# Altium project Mosaic-Alto.PrjPcb
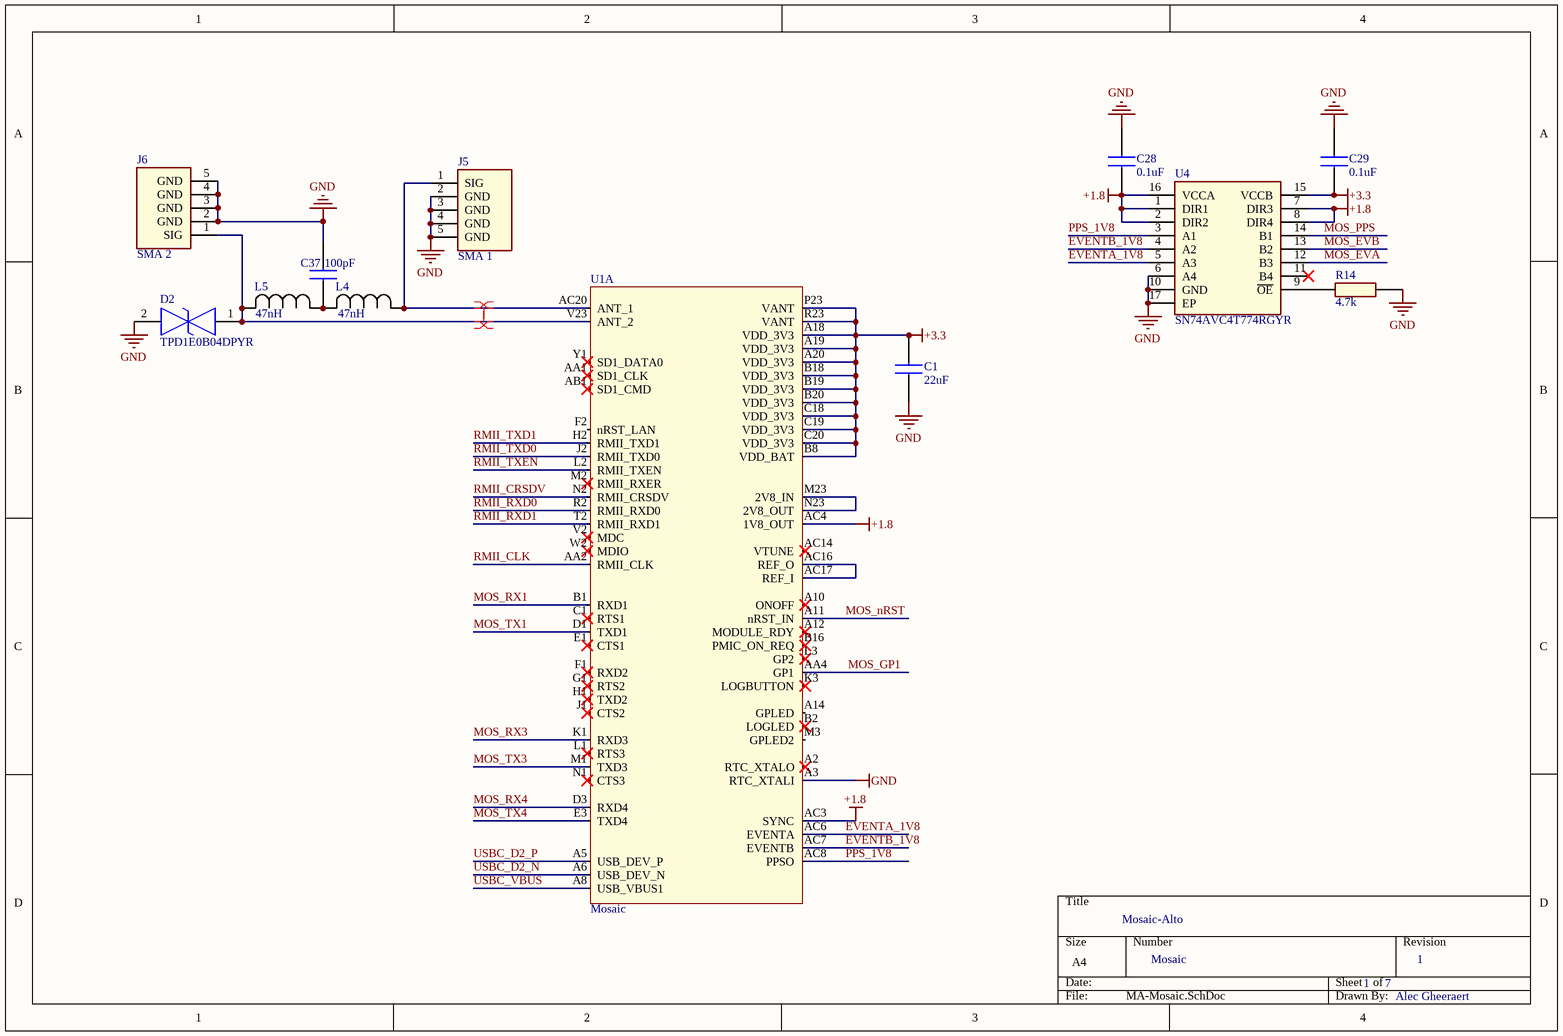
[diagram p0: MA-Mosaic.SchDoc]
7 sheets, 121 parts. Net scope: global (net labels, ports and power ports of the same name join across sheets).
Board file: Mosaic-Alto.PcbDoc
Sheets:
  MA-Mosaic.SchDoc
  MA-Ethernet.SchDoc
  MA-Support.SchDoc
  MA-Power.SchDoc
  MA-Portenta.SchDoc
  MA-USBA.SchDoc
  MA-USBC.SchDoc

## Sheet MA-Mosaic.SchDoc
size A4; SheetNumber: 1; SheetTotal: 7

### Parts
C1  22uF  [CAPC2012X145N]
C28  0.1uF  [CAPC1005X55N]
C29  0.1uF  [CAPC1005X55N]
C37  100pF  [CAPC0603X35N]
D2  TPD1E0B04DPYR  [TPD1E0B04DPYR]
J5  SMA 1  [3-1478978-1]
J6  SMA 2  [3-1478978-1]
L4  47nH  [IND_1005_TDK]
L5  47nH  [IND_1005_TDK]
R14  4.7k  [RESC1005X40N]
U1  Mosaic  [Mosaic]  (part A of 3)
U4  SN74AVC4T774RGYR  [SN74AVC4T774RGYR]

### Nets
+1.8: C28.1 U1.AC3(SYNC) U1.AC4(1V8_OUT) U4.1(DIR1) U4.2(DIR2) U4.7(DIR3) U4.8(DIR4) U4.16(VCCA)
+3.3: C1.1 C29.1 U1.A18(VDD_3V3) U1.A19(VDD_3V3) U1.A20(VDD_3V3) U1.B8(VDD_BAT) U1.B18(VDD_3V3) U1.B19(VDD_3V3) U1.B20(VDD_3V3) U1.C18(VDD_3V3) U1.C19(VDD_3V3) U1.C20(VDD_3V3) U1.P23(VANT) U1.R23(VANT) U4.15(VCCB)
GND: C1.2 C28.2 C29.2 C37.2 D2.2 J5.2(GND) J5.3(GND) J5.4(GND) J5.5(GND) J6.2(GND) J6.3(GND) J6.4(GND) J6.5(GND) R14.2 U1.A3(RTC_XTALI) U4.6(A4) U4.10(GND) U4.17(EP)
EVENTA_1V8: U1.AC6(EVENTA) U4.5(A3)
EVENTB_1V8: U1.AC7(EVENTB) U4.4(A2)
MOS_EVA: U4.12(B3)
MOS_EVB: U4.13(B2)
MOS_GP1: U1.AA4(GP1)
MOS_nRST: U1.A11(nRST_IN)
MOS_PPS: U4.14(B1)
MOS_RX1: U1.B1(RXD1)
MOS_RX3: U1.K1(RXD3)
MOS_RX4: U1.D3(RXD4)
MOS_TX1: U1.D1(TXD1)
MOS_TX3: U1.M1(TXD3)
MOS_TX4: U1.E3(TXD4)
PPS_1V8: U1.AC8(PPSO) U4.3(A1)
RMII_CLK: U1.AA2(RMII_CLK)
RMII_CRSDV: U1.N2(RMII_CRSDV)
RMII_RXD0: U1.R2(RMII_RXD0)
RMII_RXD1: U1.T2(RMII_RXD1)
RMII_TXD0: U1.J2(RMII_TXD0)
RMII_TXD1: U1.H2(RMII_TXD1)
RMII_TXEN: U1.L2(RMII_TXEN)
USBC_D2_N: U1.A6(USB_DEV_N)
USBC_D2_P: U1.A5(USB_DEV_P)
USBC_VBUS: U1.A8(USB_VBUS1)
NetC37_1: C37.1 L4.2 L5.1
NetD2_1: D2.1 J6.1(SIG) L5.2 U1.V23(ANT_2)
NetJ5_1: J5.1(SIG) L4.1 U1.AC20(ANT_1)
NetR14_1: R14.1 U4.9(~{OE})
NetU1_AC16: U1.AC16(REF_O) U1.AC17(REF_I)
NetU1_M23: U1.M23(2V8_IN) U1.N23(2V8_OUT)

Not connected (* = marked no-connect by the designer): U1 A2(RTC_XTALO)* A10(ONOFF)* A12(MODULE_RDY)* A14(GPLED) AA1(SD1_CLK)* AB1(SD1_CMD)* AC14(VTUNE)* B2(LOGLED)* B16(PMIC_ON_REQ)* C1(RTS1)* E1(CTS1)* F1(RXD2)* F2(nRST_LAN) G1(RTS2)* H1(TXD2)* J1(CTS2)* K3(LOGBUTTON)* L1(RTS3)* L3(GP2)* M2(RMII_RXER)* M3(GPLED2) N1(CTS3)* V2(MDC)* W2(MDIO)* Y1(SD1_DATA0)*; U4 11(B4)*

### Layout directives
net class ANT: NetD2_1, NetJ5_1

### Notes on the sheet
- Mosaic-Alto
- Mosaic
- 1
- 7
- Alec Gheeraert

### Library data of the parts
C1 = CMP-00053-2: 0805 22µF; Manufacturer: Walsin; Tolerance: 10%; Dielectric: X5R; Voltage Rating: 6.3V; Min Operating Temperature: 85; Capacitance: 22µF; Max Operating Temperature: -55; Package: 0805
C28 C29 = CMP-00051-3: 0402I 0.1µF; Manufacturer: Walsin; Tolerance: 10%; Dielectric: X7R; Capacitance: 100nF; Voltage Rating: 10V; Min Operating Temperature: -55; Package: 0402; Max Operating Temperature: 125
C37 = CMP-00074-2: 0201 100pF; Capacitance: 100pF
D2 = CMP-00073-2: 1 Channel TVS Diode
J5 J6 = CMP-00069-3: RF SMA Connector
L4 L5 = CMP-00072-2: 47nH 1.4GHz Inductor
R14 = CMP-00030-4: 0402I 4.7k; Manufacturer: Walsin; Power Rating: 62.5mW; Qualification: AEC-Q200; Voltage Rating: 50V; Tolerance: 1%; Max Operating Temperature: 155; Package: 0402; Min Operating Temperature: -55; Resistance: 4.7k
U1 = CMP-00046-3: GNSS RTK Receiver; Manufacturer: Septentrio; Interfaces: USB, UART; Min Operating Temperature: -40; Max Operating Temperature: 85
U4 = CMP-00060-4: 4B Dual-Supply Level Shifter; Manufacturer: Texas Instruments; Delay Time: 2.4ns; Max Supply Voltage: 3.6V; Data Rate: 380Mb/s; Bits: 4; Min Supply Voltage: 1.2V; Package: VQFN-16

## Sheet MA-Ethernet.SchDoc
size A4; SheetNumber: 2; SheetTotal: 7
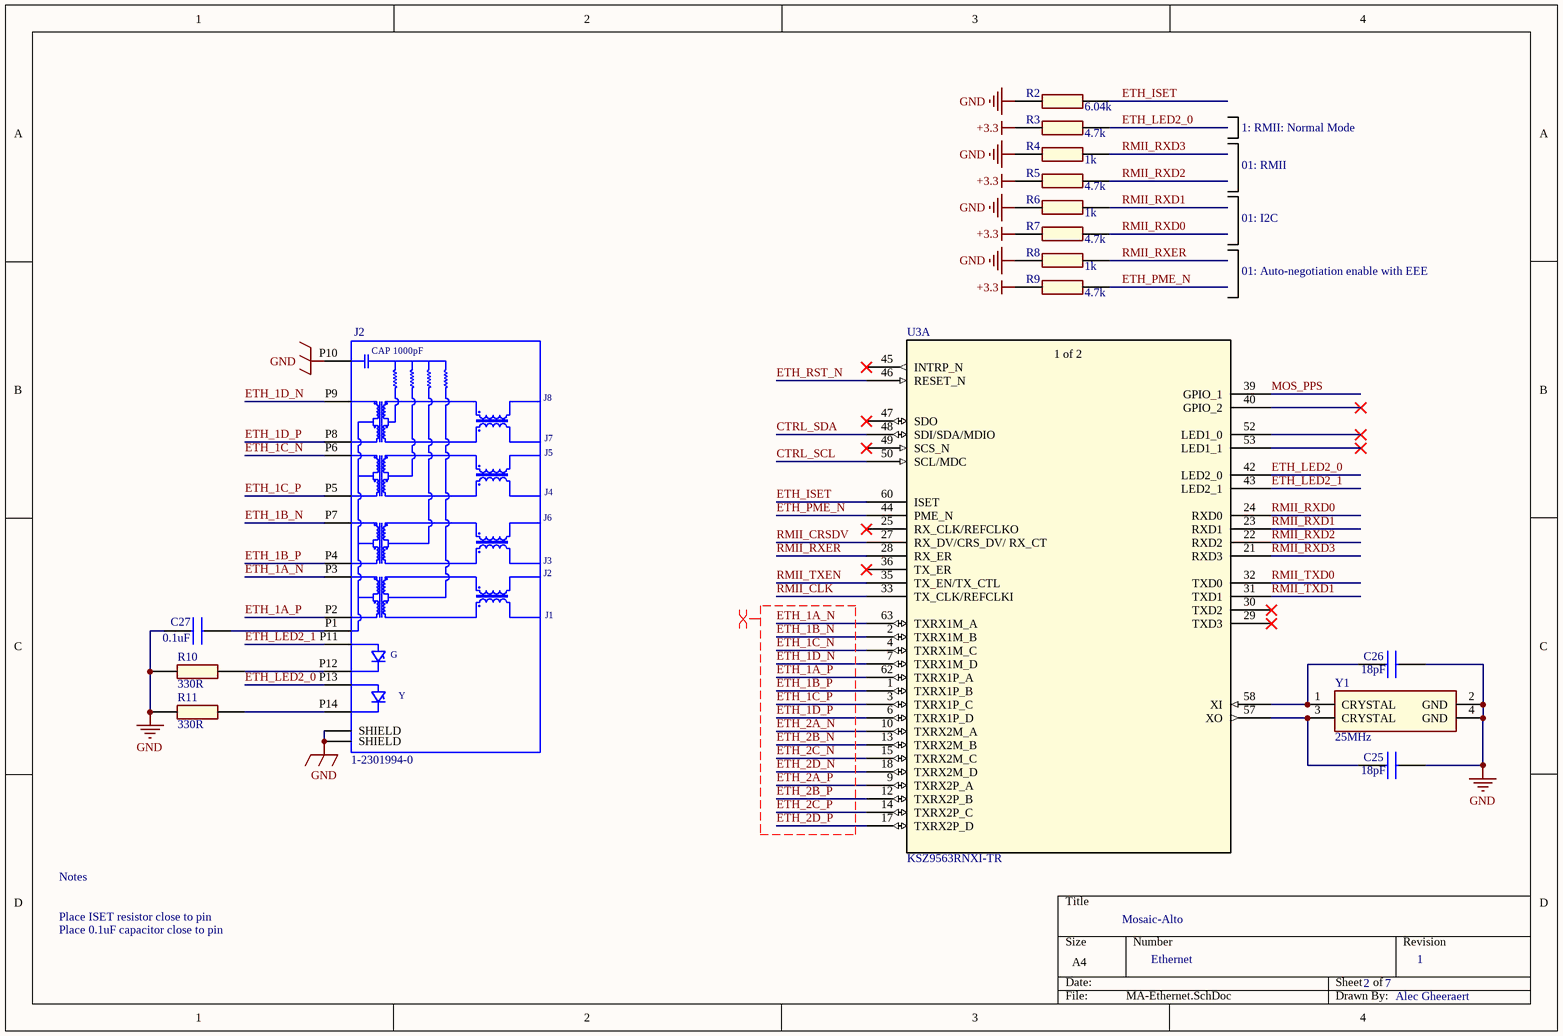
[diagram p1: MA-Ethernet.SchDoc]

### Parts
C25  18pF  [CAPC1608X87N]
C26  18pF  [CAPC1608X87N]
C27  0.1uF  [CAPC2012X145N]
J2  1-2301994-0  [1-2301994-0]
R2  6.04k  [RESC1005X40N]
R3  4.7k  [RESC1005X40N]
R4  1k  [RESC1005X40N]
R5  4.7k  [RESC1005X40N]
R6  1k  [RESC1005X40N]
R7  4.7k  [RESC1005X40N]
R8  1k  [RESC1005X40N]
R9  4.7k  [RESC1005X40N]
R10  330R  [RESC1005X40N]
R11  330R  [RESC1005X40N]
U3  KSZ9563RNXI-TR  [VQFN64_NX_MCH]  (part A of 2)
Y1  25MHz  [LFXTAL055474REEL]

### Nets
+3.3: R3.1 R5.1 R7.1 R9.1
GND: C25.2 C26.2 C27.2 J2.P10 J2.S1(SHIELD) J2.S2(SHIELD) R2.1 R4.1 R6.1 R8.1 R10.2 R11.2 Y1.2(GND) Y1.4(GND)
CTRL_SCL: U3.50(SCL/MDC)
CTRL_SDA: U3.48(SDI/SDA/MDIO)
ETH_1A_N: J2.P3 U3.63(TXRX1M_A)
ETH_1A_P: J2.P2 U3.62(TXRX1P_A)
ETH_1B_N: J2.P7 U3.2(TXRX1M_B)
ETH_1B_P: J2.P4 U3.1(TXRX1P_B)
ETH_1C_N: J2.P6 U3.4(TXRX1M_C)
ETH_1C_P: J2.P5 U3.3(TXRX1P_C)
ETH_1D_N: J2.P9 U3.7(TXRX1M_D)
ETH_1D_P: J2.P8 U3.6(TXRX1P_D)
ETH_2A_N: U3.10(TXRX2M_A)
ETH_2A_P: U3.9(TXRX2P_A)
ETH_2B_N: U3.13(TXRX2M_B)
ETH_2B_P: U3.12(TXRX2P_B)
ETH_2C_N: U3.15(TXRX2M_C)
ETH_2C_P: U3.14(TXRX2P_C)
ETH_2D_N: U3.18(TXRX2M_D)
ETH_2D_P: U3.17(TXRX2P_D)
ETH_ISET: R2.2 U3.60(ISET)
ETH_LED2_0: J2.P13 R3.2 U3.42(LED2_0)
ETH_LED2_1: J2.P11 U3.43(LED2_1)
ETH_PME_N: R9.2 U3.44(PME_N)
ETH_RST_N: U3.46(RESET_N)
MOS_PPS: U3.39(GPIO_1)
RMII_CLK: U3.33(TX_CLK/REFCLKI)
RMII_CRSDV: U3.27(RX_DV/CRS_DV/_RX_CT)
RMII_RXD0: R7.2 U3.24(RXD0)
RMII_RXD1: R6.2 U3.23(RXD1)
RMII_RXD2: R5.2 U3.22(RXD2)
RMII_RXD3: R4.2 U3.21(RXD3)
RMII_RXER: R8.2 U3.28(RX_ER)
RMII_TXD0: U3.32(TXD0)
RMII_TXD1: U3.31(TXD1)
RMII_TXEN: U3.35(TX_EN/TX_CTL)
NetC25_1: C25.1 U3.57(XO) Y1.3(CRYSTAL)
NetC26_1: C26.1 U3.58(XI) Y1.1(CRYSTAL)
NetC27_1: C27.1 J2.P1
NetJ2_P12: J2.P12 R10.1
NetJ2_P14: J2.P14 R11.1

Not connected (* = marked no-connect by the designer): U3 25(RX_CLK/REFCLKO)* 29(TXD3)* 30(TXD2)* 36(TX_ER)* 40(GPIO_2)* 45(INTRP_N)* 47(SDO)* 49(SCS_N)* 52(LED1_0)* 53(LED1_1)*

### Layout directives
differential pair; differential pair class ETH; net class ETH: ETH_1A_N, ETH_1A_P, ETH_1B_N, ETH_1B_P, ETH_1C_N, ETH_1C_P, ETH_1D_N, ETH_1D_P, ETH_2A_N, ETH_2A_P, ETH_2B_N, ETH_2B_P, ETH_2C_N, ETH_2C_P, ETH_2D_N, ETH_2D_P

### Notes on the sheet
- 01: RMII
- 1: RMII: Normal Mode
- 01: I2C
- 01: Auto-negotiation enable with EEE
- Place ISET resistor close to pin
- Notes
- Mosaic-Alto
- Place 0.1uF capacitor close to pin
- Ethernet
- 2
- 7
- 1
- Alec Gheeraert
- (in symbol CMP-00040-2) CAP 1000pF; J8; J7; J5; J4; J6; J3; J1; G; Y
- (in symbol CMP-00057-8, part A) 1 of 2

### Library data of the parts
C25 C26 = CMP-00052-2: 0603 18pF; Manufacturer: Walsin; Dielectric: C0G; Tolerance: 5%; Voltage Rating: 16V; Max Operating Temperature: 125; Package: 0603; Min Operating Temperature: -55; Capacitance: 18pF
C27 = CMP-00059-1: 0805I 0.1µF; Manufacturer: Walsin; Voltage Rating: 50V; Capacitance: 100nF; Qualification: AEC-Q200; Dielectric: X7R; Tolerance: 10%; Min Operating Temperature: 125; Max Operating Temperature: -55; Package: 0805
J2 = CMP-00040-2: RJ45 1Gbit MJ; Manufacturer: TE Connectivity; Magnetic Jack: Yes; Mounting Angle: Right; Data Rate: 10/100/1000 Base-T; Gender: Female; Performance Category: 5e; Max Operating Temperature: 85; USOC: RJ45; Shielding: Yes; Mounting Style: Through Hole; Min Operating Temperature: -40
R2 = CMP-00031-4: 0402I 6.04k; Manufacturer: Walsin; Qualification: AEC-Q200; Tolerance: 1%; Voltage Rating: 50V; Power Rating: 62.5mW; Max Operating Temperature: 155; Resistance: 6.04k; Min Operating Temperature: -55; Package: 0402
R3 R5 R7 R9 = CMP-00030-4: as R14 on sheet MA-Mosaic; Max Operating Temperature: 155; Package: 0402; Min Operating Temperature: -55; Resistance: 4.7k
R4 R6 R8 = CMP-00032-3: 0402I 1k; Manufacturer: Walsin; Voltage Rating: 50V; Qualification: AEC-Q200; Power Rating: 62.5mW; Tolerance: 1%; Max Operating Temperature: 155; Resistance: 1k; Package: 0402; Min Operating Temperature: -55
R10 R11 = CMP-00028-4: 0402I 330; Manufacturer: Walsin; Resistance: 330; Qualification: AEC-Q200; Voltage Rating: 50V; Tolerance: 1%; Power Rating: 62.5mW; Max Operating Temperature: 155; Package: 0402; Min Operating Temperature: -55
U3 = CMP-00057-8: 3-Port Gigabit Ethernet Switch; Manufacturer: Texas Instruments; Transceivers: 2; Interfaces: I2C, MII, RGMII, RMII, SPI; Data Rate: 10/100/1000; Ethernet Type: 10/1000 Base-T, 100 Base-TX; Package: VQFN-64; Min Operating Temperature: -40; Max Operating Temperature: 85
Y1 = CMP-00049-4: 25MHz +/-50ppm Crystal; Manufacturer: IQD; Drive Level: 100µW; ESR: 50; Tolerance: 50PPM; Load Capacitance: 16pF; Package: 3.2mm x 2.5mm; Frequency: 25MHz; Min Operating Temperature: -40; Max Operating Temperature: 85

## Sheet MA-Support.SchDoc
size A4; SheetNumber: 3; SheetTotal: 7
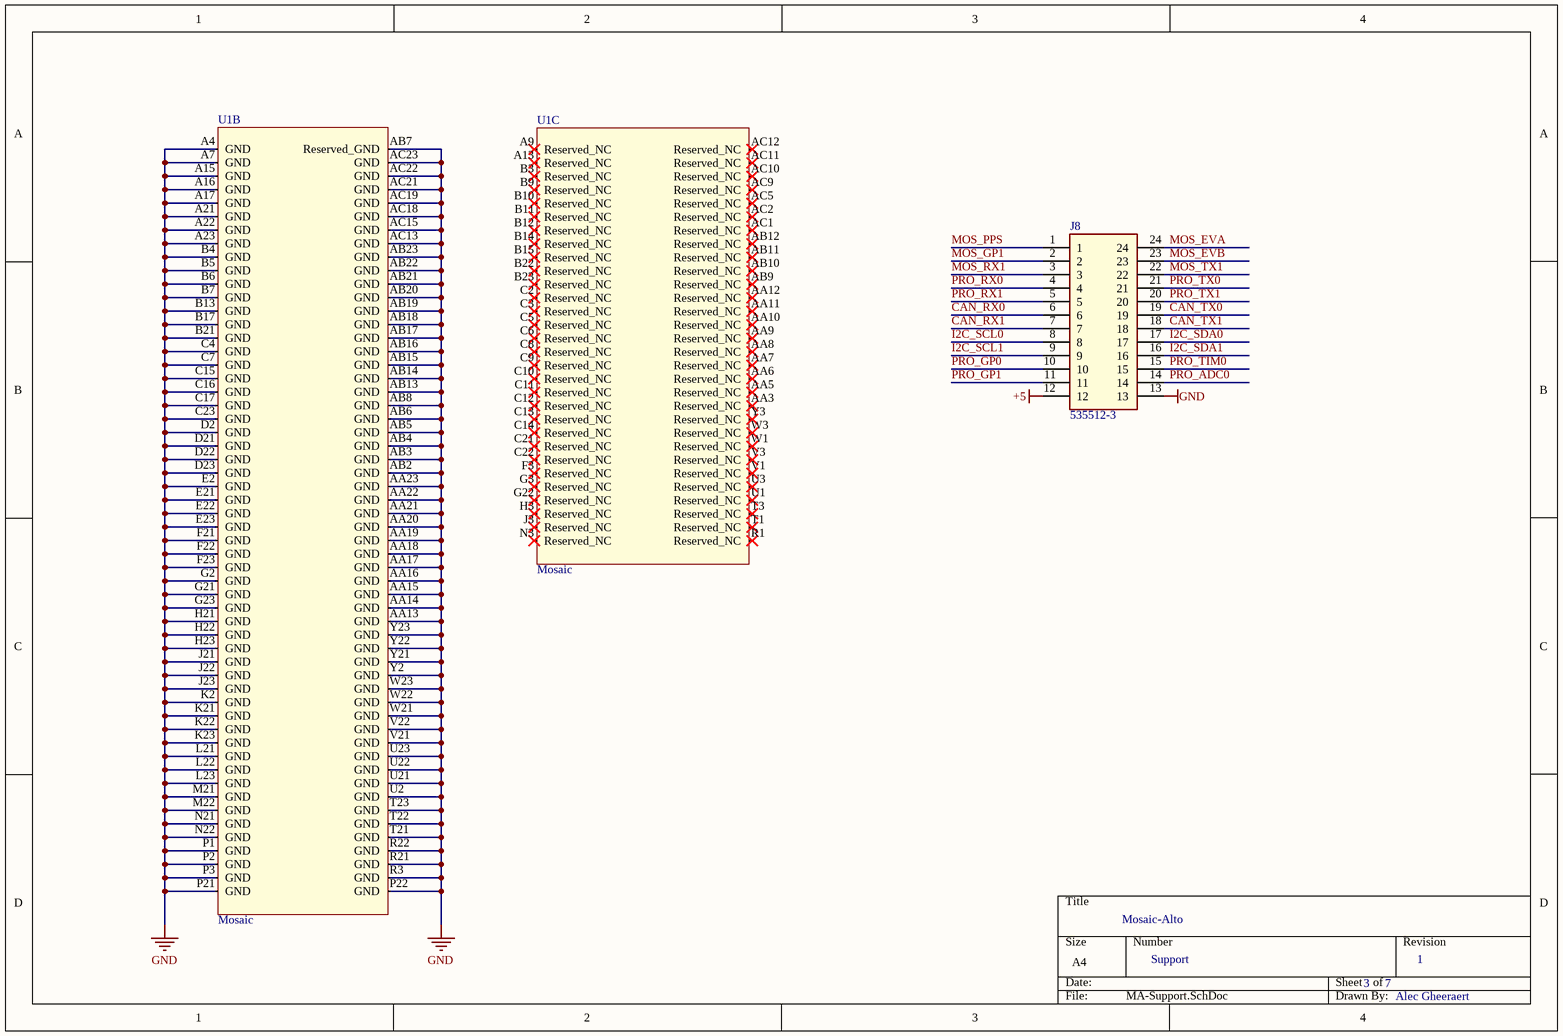
[diagram p2: MA-Support.SchDoc]

### Parts
J8  535512-3  [5355123]
U1  Mosaic  [Mosaic]  (parts B,C of 3)

### Nets
+5: J8.12
GND: J8.13 U1.A4(GND) U1.A7(GND) U1.A15(GND) U1.A16(GND) U1.A17(GND) U1.A21(GND) U1.A22(GND) U1.A23(GND) U1.AA13(GND) U1.AA14(GND) U1.AA15(GND) U1.AA16(GND) U1.AA17(GND) U1.AA18(GND) U1.AA19(GND) U1.AA20(GND) U1.AA21(GND) U1.AA22(GND) U1.AA23(GND) U1.AB2(GND) U1.AB3(GND) U1.AB4(GND) U1.AB5(GND) U1.AB6(GND) U1.AB7(Reserved_GND) U1.AB8(GND) U1.AB13(GND) U1.AB14(GND) U1.AB15(GND) U1.AB16(GND) U1.AB17(GND) U1.AB18(GND) U1.AB19(GND) U1.AB20(GND) U1.AB21(GND) U1.AB22(GND) U1.AB23(GND) U1.AC13(GND) U1.AC15(GND) U1.AC18(GND) U1.AC19(GND) U1.AC21(GND) U1.AC22(GND) U1.AC23(GND) U1.B4(GND) U1.B5(GND) U1.B6(GND) U1.B7(GND) U1.B13(GND) U1.B17(GND) U1.B21(GND) U1.C4(GND) U1.C7(GND) U1.C15(GND) U1.C16(GND) U1.C17(GND) U1.C23(GND) U1.D2(GND) U1.D21(GND) U1.D22(GND) U1.D23(GND) U1.E2(GND) U1.E21(GND) U1.E22(GND) U1.E23(GND) U1.F21(GND) U1.F22(GND) U1.F23(GND) U1.G2(GND) U1.G21(GND) U1.G23(GND) U1.H21(GND) U1.H22(GND) U1.H23(GND) U1.J21(GND) U1.J22(GND) U1.J23(GND) U1.K2(GND) U1.K21(GND) U1.K22(GND) U1.K23(GND) U1.L21(GND) U1.L22(GND) U1.L23(GND) U1.M21(GND) U1.M22(GND) U1.N21(GND) U1.N22(GND) U1.P1(GND) U1.P2(GND) U1.P3(GND) U1.P21(GND) U1.P22(GND) U1.R3(GND) U1.R21(GND) U1.R22(GND) U1.T21(GND) U1.T22(GND) U1.T23(GND) U1.U2(GND) U1.U21(GND) U1.U22(GND) U1.U23(GND) U1.V21(GND) U1.V22(GND) U1.W21(GND) U1.W22(GND) U1.W23(GND) U1.Y2(GND) U1.Y21(GND) U1.Y22(GND) U1.Y23(GND)
CAN_RX0: J8.6
CAN_RX1: J8.7
CAN_TX0: J8.19
CAN_TX1: J8.18
I2C_SCL0: J8.8
I2C_SCL1: J8.9
I2C_SDA0: J8.17
I2C_SDA1: J8.16
MOS_EVA: J8.24
MOS_EVB: J8.23
MOS_GP1: J8.2
MOS_PPS: J8.1
MOS_RX1: J8.3
MOS_TX1: J8.22
PRO_ADC0: J8.14
PRO_GP0: J8.10
PRO_GP1: J8.11
PRO_RX0: J8.4
PRO_RX1: J8.5
PRO_TIM0: J8.15
PRO_TX0: J8.21
PRO_TX1: J8.20

Not connected (* = marked no-connect by the designer): U1 A9(Reserved_NC)* A13(Reserved_NC)* AA3(Reserved_NC)* AA5(Reserved_NC)* AA6(Reserved_NC)* AA7(Reserved_NC)* AA8(Reserved_NC)* AA9(Reserved_NC)* AA10(Reserved_NC)* AA11(Reserved_NC)* AA12(Reserved_NC)* AB9(Reserved_NC)* AB10(Reserved_NC)* AB11(Reserved_NC)* AB12(Reserved_NC)* AC1(Reserved_NC)* AC2(Reserved_NC)* AC5(Reserved_NC)* AC9(Reserved_NC)* AC10(Reserved_NC)* AC11(Reserved_NC)* AC12(Reserved_NC)* B3(Reserved_NC)* B9(Reserved_NC)* B10(Reserved_NC)* B11(Reserved_NC)* B12(Reserved_NC)* B14(Reserved_NC)* B15(Reserved_NC)* B22(Reserved_NC)* B23(Reserved_NC)* C2(Reserved_NC)* C3(Reserved_NC)* C5(Reserved_NC)* C6(Reserved_NC)* C8(Reserved_NC)* C9(Reserved_NC)* C10(Reserved_NC)* C11(Reserved_NC)* C12(Reserved_NC)* C13(Reserved_NC)* C14(Reserved_NC)* C21(Reserved_NC)* C22(Reserved_NC)* F3(Reserved_NC)* G3(Reserved_NC)* G22(Reserved_NC)* H3(Reserved_NC)* J3(Reserved_NC)* N3(Reserved_NC)* R1(Reserved_NC)* T1(Reserved_NC)* T3(Reserved_NC)* U1(Reserved_NC)* U3(Reserved_NC)* V1(Reserved_NC)* V3(Reserved_NC)* W1(Reserved_NC)* W3(Reserved_NC)* Y3(Reserved_NC)*

### Notes on the sheet
- Mosaic-Alto
- Support
- 3
- 7
- 1
- Alec Gheeraert

### Library data of the parts
J8 = CMP-00086-2: 24 Pin Right Angle Female Header
U1 = CMP-00046-3: as U1 on sheet MA-Mosaic; Min Operating Temperature: -40; Max Operating Temperature: 85

## Sheet MA-Power.SchDoc
size A4; SheetNumber: 4; SheetTotal: 7
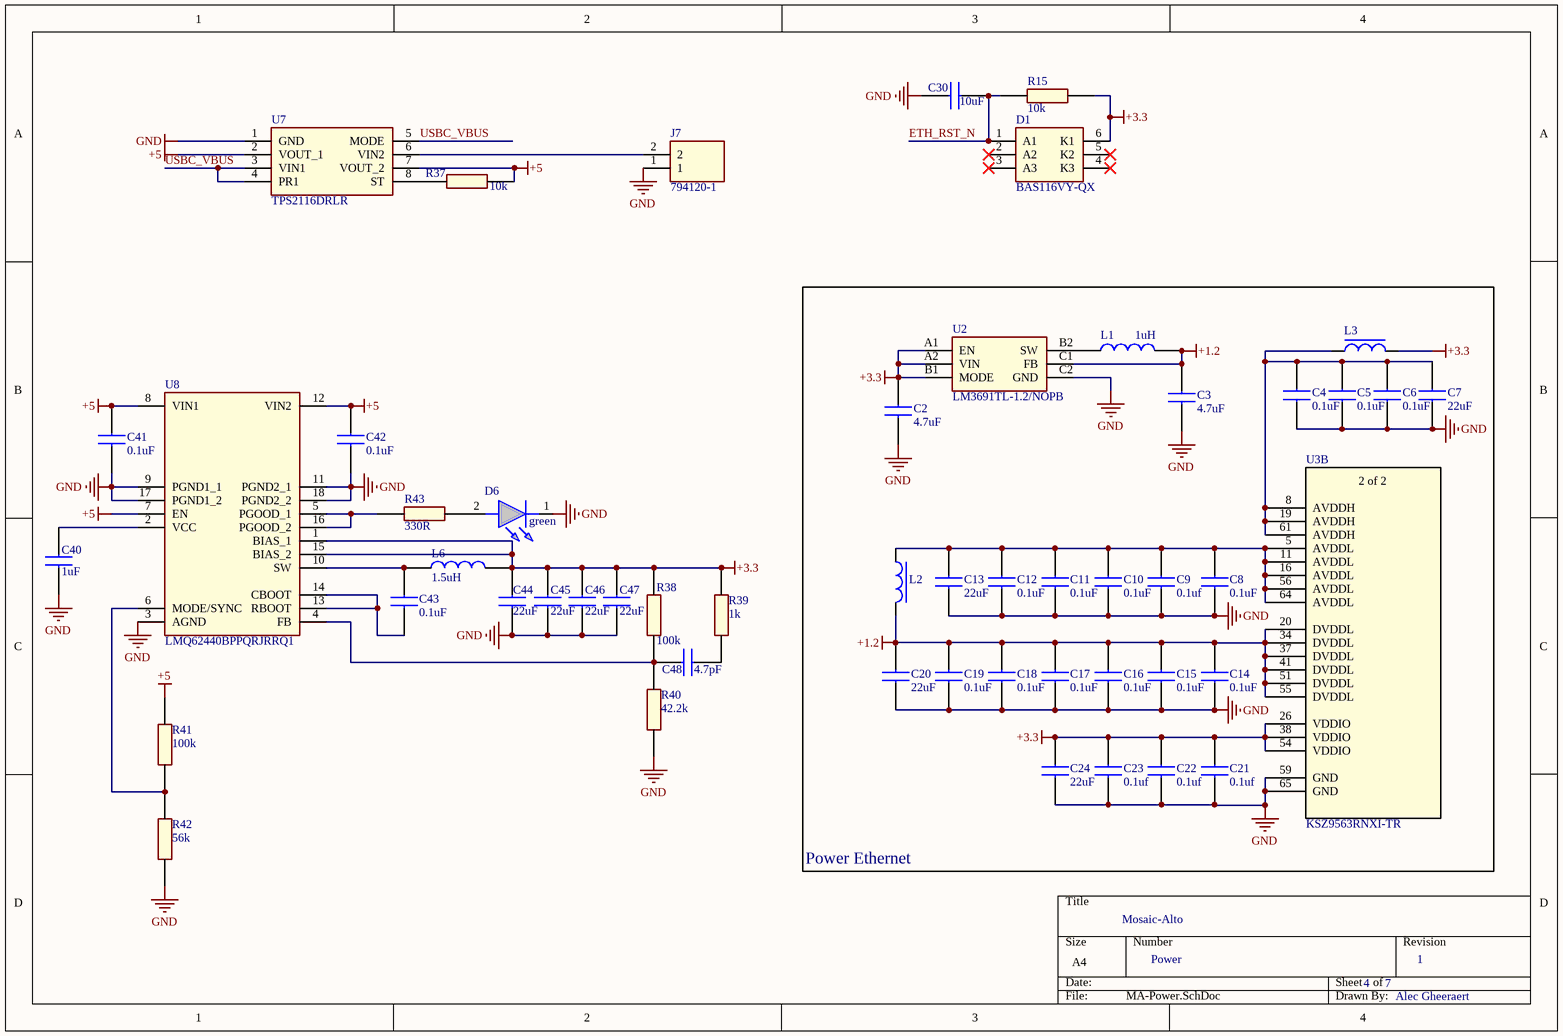
[diagram p3: MA-Power.SchDoc]

### Parts
C2  4.7uF  [CAPC1608X100N]
C3  4.7uF  [CAPC1608X100N]
C4  0.1uF  [CAPC1005X55N]
C5  0.1uF  [CAPC1005X55N]
C6  0.1uF  [CAPC1005X55N]
C7  22uF  [CAPC2012X145N]
C8  0.1uF  [CAPC1005X55N]
C9  0.1uf  [CAPC1005X55N]
C10  0.1uF  [CAPC1005X55N]
C11  0.1uF  [CAPC1005X55N]
C12  0.1uF  [CAPC1005X55N]
C13  22uF  [CAPC2012X145N]
C14  0.1uF  [CAPC1005X55N]
C15  0.1uF  [CAPC1005X55N]
C16  0.1uF  [CAPC1005X55N]
C17  0.1uF  [CAPC1005X55N]
C18  0.1uF  [CAPC1005X55N]
C19  0.1uF  [CAPC1005X55N]
C20  22uF  [CAPC2012X145N]
C21  0.1uf  [CAPC1005X55N]
C22  0.1uf  [CAPC1005X55N]
C23  0.1uf  [CAPC1005X55N]
C24  22uF  [CAPC2012X145N]
C30  10uF  [CAPC1608X100N]
C40  1uF  [CAPC1608X100N]
C41  0.1uF  [CAPC2012X145N]
C42  0.1uF  [CAPC2012X145N]
C43  0.1uF  [CAPC1005X55N]
C44  22uF  [CAPC2012X145N]
C45  22uF  [CAPC2012X145N]
C46  22uF  [CAPC2012X145N]
C47  22uF  [CAPC2012X145N]
C48  4.7pF  [CAPC1608X87N]
D1  BAS116VY-QX  [BAS116VYQX]
D6  green  [APT1608ZGCAMT]
J7  794120-1  [7941201]
L1  1uH  [INDC2016X100N]
L2  MPZ1608S121ATDH5  [BEADC1608X75N]  (value not drawn)
L3  MPZ1608S121ATDH5  [BEADC1608X75N]  (value not drawn)
L6  1.5uH  [INDC1005X55N]
R15  10k  [RESC1005X40N]
R37  10k  [RESC1005X40N]
R38  100k  [RESC1005X40N]
R39  1k  [RESC1005X40N]
R40  42.2k  [RESC1005X40N]
R41  100k  [RESC1005X40N]
R42  56k  [RESC1005X40N]
R43  330R  [RESC1005X40N]
U2  LM3691TL-1.2/NOPB  [BGA6C50P2X3_126X156X68]
U3  KSZ9563RNXI-TR  [VQFN64_NX_MCH]  (part B of 2)
U7  TPS2116DRLR  [SOTFL50P160X60-8N]
U8  LMQ62440BPPQRJRRQ1  [LMQ62440BPPQRJRRQ1]

### Blocks framed on the sheet
Power Ethernet: C2-C24 L1-L3 U2 U3

### Nets
+1.2: C3.1 C14.1 C15.1 C16.1 C17.1 C18.1 C19.1 C20.1 L1.2 L2.2 U2.C1(FB) U3.20(DVDDL) U3.34(DVDDL) U3.37(DVDDL) U3.41(DVDDL) U3.51(DVDDL) U3.55(DVDDL)
+3.3: C2.1 C21.1 C22.1 C23.1 C24.1 C44.1 C45.1 C46.1 C47.1 D1.6(K1) L3.2 L6.2 R15.1 R38.1 R39.2 U2.A1(EN) U2.A2(VIN) U2.B1(MODE) U3.26(VDDIO) U3.38(VDDIO) U3.54(VDDIO) U8.1(BIAS_1) U8.15(BIAS_2)
+5: C41.1 C42.1 R37.2 R41.2 U7.2(VOUT_1) U7.7(VOUT_2) U8.7(EN) U8.8(VIN1) U8.12(VIN2)
GND: C2.2 C3.2 C4.2 C5.2 C6.2 C7.2 C8.2 C9.2 C10.2 C11.2 C12.2 C13.2 C14.2 C15.2 C16.2 C17.2 C18.2 C19.2 C20.2 C21.2 C22.2 C23.2 C24.2 C30.2 C40.2 C41.2 C42.2 C44.2 C45.2 C46.2 C47.2 D6.1(K) J7.1 R40.2 R42.2 U2.C2(GND) U3.59(GND) U3.65(GND) U7.1(GND) U8.3(AGND) U8.9(PGND1_1) U8.11(PGND2_1) U8.17(PGND1_2) U8.18(PGND2_2)
ETH_RST_N: C30.1 D1.1(A1) R15.2
USBC_VBUS: U7.3(VIN1) U7.4(PR1) U7.5(MODE)
NetC4_1: C4.1 C5.1 C6.1 C7.1 L3.1 U3.8(AVDDH) U3.19(AVDDH) U3.61(AVDDH)
NetC8_1: C8.1 C9.1 C10.1 C11.1 C12.1 C13.1 L2.1 U3.5(AVDDL) U3.11(AVDDL) U3.16(AVDDL) U3.56(AVDDL) U3.64(AVDDL)
NetC40_1: C40.1 U8.2(VCC)
NetC43_1: C43.1 L6.1 U8.10(SW)
NetC43_2: C43.2 U8.13(RBOOT) U8.14(CBOOT)
NetC48_1: C48.1 R38.2 R40.1 U8.4(FB)
NetC48_2: C48.2 R39.1
NetD6_2: D6.2(A) R43.2
NetJ7_2: J7.2 U7.6(VIN2)
NetL1_1: L1.1 U2.B2(SW)
NetR37_1: R37.1 U7.8(ST)
NetR41_1: R41.1 R42.1 U8.6(MODE/SYNC)
NetR43_1: R43.1 U8.5(PGOOD_1) U8.16(PGOOD_2)

Not connected (* = marked no-connect by the designer): D1 2(A2)* 3(A3)* 4(K3)* 5(K2)*

### Notes on the sheet
- Mosaic-Alto
- Power
- 4
- 7
- 1
- Alec Gheeraert
- (in symbol CMP-00057-8, part B) 2 of 2

### Library data of the parts
C2 C3 = CMP-00054-2: 0603 4.7µF; Manufacturer: Walsin; Tolerance: 20%; Voltage Rating: 6.3V; Dielectric: X5R; Max Operating Temperature: 85; Capacitance: 4.7µF; Min Operating Temperature: -55; Package: 0603
C4-C6 C8-C12 C14-C19 C21-C23 C43 = CMP-00051-3: as C28 on sheet MA-Mosaic; Min Operating Temperature: -55; Package: 0402; Max Operating Temperature: 125
C7 C13 C20 C24 C44-C47 = CMP-00053-2: as C1 on sheet MA-Mosaic; Min Operating Temperature: 85; Capacitance: 22µF; Max Operating Temperature: -55; Package: 0805
C30 = CMP-00062-1: 0603 10µF; Manufacturer: Walsin; Dielectric: X5R; Voltage Rating: 6.3V; Tolerance: 10%; Max Operating Temperature: 85; Min Operating Temperature: -55; Package: 0603; Capacitance: 10µF
C40 = CMP-00064-1: 0603 1µF; Manufacturer: Walsin; Tolerance: 10%; Dielectric: X5R; Voltage Rating: 6.3V; Package: 0603; Min Operating Temperature: -55; Max Operating Temperature: 85; Capacitance: 1µF
C41 C42 = CMP-00059-1: as C27 on sheet MA-Ethernet; Min Operating Temperature: 125; Max Operating Temperature: -55; Package: 0805
C48 = CMP-00085-1: 0603 4.7pF; Manufacturer: Walsin; Voltage Rating: 16V; Tolerance: 5%; Dielectric: C0G; Min Operating Temperature: -55; Package: 0603; Capacitance: 4.7pF; Max Operating Temperature: 125
D1 = CMP-00061-3: Triple Diode Array; Manufacturer: Nexperia; Forward Current: 180mA; Max Surge Current: 10A; Forward Voltage: 1.25V; Peak Reverse Voltage: 85V; Reverse Current: 5nA; Configuration: Triple; Package: TSSOP-6
D6 = CMP-00079-2: 0603 Green LED; Colour: Green
J7 = CMP-00082-2: Right Angle PCB Header
L1 = CMP-00048-2: 1µH Inductor; Manufacturer: TDK; Shielding: Yes; Max Current: 1.3A; Tolerance: 20%; Max Resistance: 90; Package: 0806; Inductance: 1µH; Min Operating Temperature: -40; Max Operating Temperature: 125
L2 L3 = CMP-00050-4: 0603I 120ohms Ferrite Bead; Manufacturer: TDK; Tolerance: 25%; Qualification: AEC-Q200; Resistance Rating: 120; Current Rating: 2A; Max Operating Temperature: 125; Min Operating Temperature: -55; Package: 0603
L6 = CMP-00083-2: 1.5uH Inductor
R15 R37 = CMP-00026-5: 0402I 10k; Manufacturer: Walsin; Qualification: AEC-Q200; Tolerance: 1%; Voltage Rating: 50V; Power Rating: 62.5mW; Max Operating Temperature: 155; Resistance: 10k; Package: 0402; Min Operating Temperature: -55
R38 R41 = CMP-00029-4: 0402I 100k; Manufacturer: Walsin; Voltage Rating: 50V; Power Rating: 62.5mW; Qualification: AEC-Q200; Tolerance: 1%; Package: 0402; Resistance: 100k; Max Operating Temperature: 155; Min Operating Temperature: -55
R39 = CMP-00032-3: as R4 on sheet MA-Ethernet; Max Operating Temperature: 155; Resistance: 1k; Package: 0402; Min Operating Temperature: -55
R40 = CMP-00084-1: 0402I 42.2k; Manufacturer: Walsin; Power Rating: 62.5mW; Tolerance: 1%; Voltage Rating: 50V; Qualification: AEC-Q200; Resistance: 42.2k; Max Operating Temperature: 155; Min Operating Temperature: -55; Package: 0402
R42 = CMP-00075-1: 0402I 56k; Manufacturer: Walsin; Tolerance: 1%; Qualification: AEC-Q200; Voltage Rating: 50V; Power Rating: 62.5mW; Package: 0402; Resistance: 56k; Min Operating Temperature: -55; Max Operating Temperature: 155
R43 = CMP-00028-4: as R10 on sheet MA-Ethernet; Max Operating Temperature: 155; Package: 0402; Min Operating Temperature: -55
U2 = CMP-00047-3: 1.2V 1A Buck Converter; Manufacturer: Texas Instruments; Channels: 1; Max Input Voltage: 5.5V; Min Input Voltage: 2.3V; Frequency: 4MHz; Min Operating Temperature: -30; Topology: Buck; Max Output Voltage: 1.2V; Max Operating Temperature: 85; Min Output Voltage: 1.2V; Package: DSBGA-6; Output Current: 1A
U3 = CMP-00057-8: as U3 on sheet MA-Ethernet; Package: VQFN-64; Min Operating Temperature: -40; Max Operating Temperature: 85
U7 = CMP-00080-3: 2.5A Power Multiplexer; Manufacturer: Texas Instruments; Max Input Voltage: 5.5V; Outputs: 1; Min Input Voltage: 1.6V; Current Rating: 2.5A; Min Operating Temperature: -40; Max Operating Temperature: 105
U8 = CMP-00081-2: 3.3V 4A Switching Voltage Regulator; Manufacturer: Texas Instruments; Min Input Voltage: 3V; Max Input Voltage: 36V; Topology: Buck; Frequency: 2.1MHz; Channels: 1; Max Output Voltage: 3.3V; Max Operating Temperature: 150; Min Output Voltage: 3.3V; Min Operating Temperature: -40; Output Current: 4A; Package: VQFN-14

## Sheet MA-Portenta.SchDoc
size A4; SheetNumber: 5; SheetTotal: 7
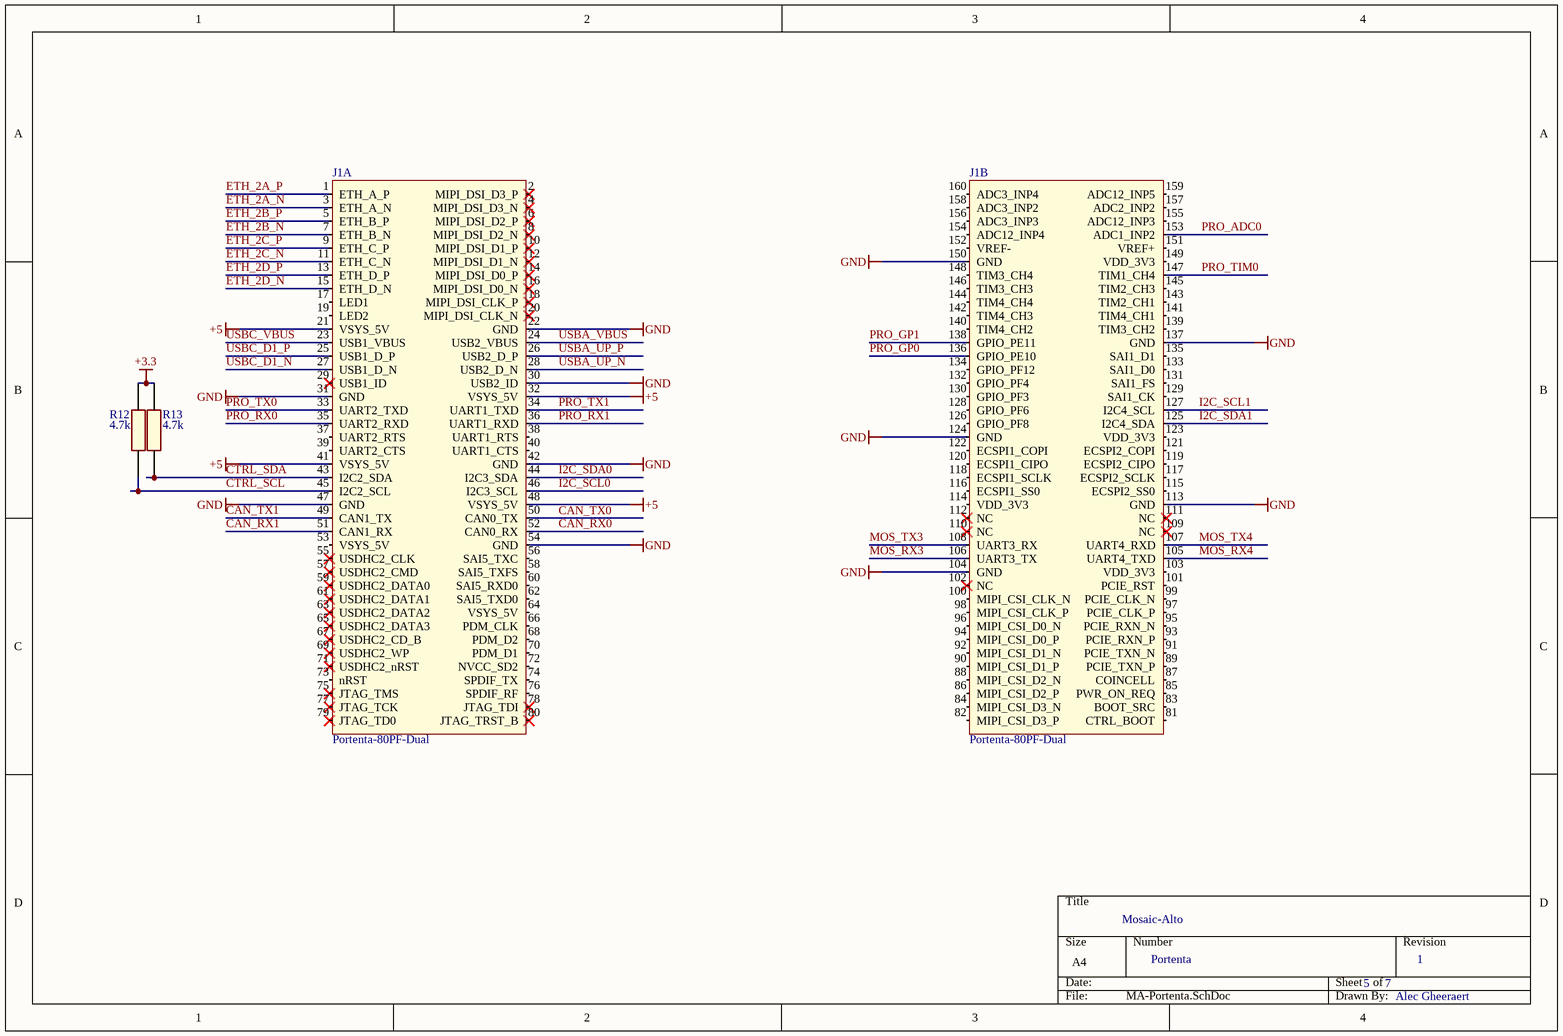
[diagram p4: MA-Portenta.SchDoc]

### Parts
J1  Portenta-80PF-Dual  [HRS_DF40C-80DP-0.4V(51)]  (parts A,B of 2)
R12  4.7k  [RESC1005X40N]
R13  4.7k  [RESC1005X40N]

### Nets
+3.3: R12.2 R13.1
+5: J1.21(VSYS_5V) J1.32(VSYS_5V) J1.41(VSYS_5V) J1.48(VSYS_5V)
GND: J1.22(GND) J1.30(USB2_ID) J1.31(GND) J1.42(GND) J1.47(GND) J1.54(GND) J1.104(GND) J1.113(GND) J1.124(GND) J1.137(GND) J1.150(GND)
CAN_RX0: J1.52(CAN0_RX)
CAN_RX1: J1.51(CAN1_RX)
CAN_TX0: J1.50(CAN0_TX)
CAN_TX1: J1.49(CAN1_TX)
CTRL_SCL: J1.45(I2C2_SCL) R12.1
CTRL_SDA: J1.43(I2C2_SDA) R13.2
ETH_2A_N: J1.3(ETH_A_N)
ETH_2A_P: J1.1(ETH_A_P)
ETH_2B_N: J1.7(ETH_B_N)
ETH_2B_P: J1.5(ETH_B_P)
ETH_2C_N: J1.11(ETH_C_N)
ETH_2C_P: J1.9(ETH_C_P)
ETH_2D_N: J1.15(ETH_D_N)
ETH_2D_P: J1.13(ETH_D_P)
I2C_SCL0: J1.46(I2C3_SCL)
I2C_SCL1: J1.127(I2C4_SCL)
I2C_SDA0: J1.44(I2C3_SDA)
I2C_SDA1: J1.125(I2C4_SDA)
MOS_RX3: J1.106(UART3_TX)
MOS_RX4: J1.105(UART4_TXD)
MOS_TX3: J1.108(UART3_RX)
MOS_TX4: J1.107(UART4_RXD)
PRO_ADC0: J1.153(ADC1_INP2)
PRO_GP0: J1.136(GPIO_PE10)
PRO_GP1: J1.138(GPIO_PE11)
PRO_RX0: J1.35(UART2_RXD)
PRO_RX1: J1.36(UART1_RXD)
PRO_TIM0: J1.147(TIM1_CH4)
PRO_TX0: J1.33(UART2_TXD)
PRO_TX1: J1.34(UART1_TXD)
USBA_UP_N: J1.28(USB2_D_N)
USBA_UP_P: J1.26(USB2_D_P)
USBA_VBUS: J1.24(USB2_VBUS)
USBC_D1_N: J1.27(USB1_D_N)
USBC_D1_P: J1.25(USB1_D_P)
USBC_VBUS: J1.23(USB1_VBUS)

Not connected (* = marked no-connect by the designer): J1 2(MIPI_DSI_D3_P)* 4(MIPI_DSI_D3_N)* 6(MIPI_DSI_D2_P)* 8(MIPI_DSI_D2_N)* 10(MIPI_DSI_D1_P)* 12(MIPI_DSI_D1_N)* 14(MIPI_DSI_D0_P)* 16(MIPI_DSI_D0_N)* 17(LED1) 18(MIPI_DSI_CLK_P)* 19(LED2) 20(MIPI_DSI_CLK_N)* 29(USB1_ID)* 37(UART2_RTS) 38(UART1_RTS) 39(UART2_CTS) 40(UART1_CTS) 53(VSYS_5V) 55(USDHC2_CLK)* 56(SAI5_TXC) 57(USDHC2_CMD)* 58(SAI5_TXFS) 59(USDHC2_DATA0)* 60(SAI5_RXD0) 61(USDHC2_DATA1)* 62(SAI5_TXD0) 63(USDHC2_DATA2)* 64(VSYS_5V) 65(USDHC2_DATA3)* 66(PDM_CLK) 67(USDHC2_CD_B)* 68(PDM_D2) 69(USDHC2_WP)* 70(PDM_D1) 71(USDHC2_nRST)* 72(NVCC_SD2) 73(nRST) 74(SPDIF_TX) 75(JTAG_TMS)* 76(SPDIF_RF) 77(JTAG_TCK)* 78(JTAG_TDI)* 79(JTAG_TD0)* 80(JTAG_TRST_B)* 81(CTRL_BOOT) 82(MIPI_CSI_D3_P) 83(BOOT_SRC) 84(MIPI_CSI_D3_N) 85(PWR_ON_REQ) 86(MIPI_CSI_D2_P) 87(COINCELL) 88(MIPI_CSI_D2_N) 89(PCIE_TXN_P) 90(MIPI_CSI_D1_P) 91(PCIE_TXN_N) 92(MIPI_CSI_D1_N) 93(PCIE_RXN_P) 94(MIPI_CSI_D0_P) 95(PCIE_RXN_N) 96(MIPI_CSI_D0_N) 97(PCIE_CLK_P) 98(MIPI_CSI_CLK_P) 99(PCIE_CLK_N) 100(MIPI_CSI_CLK_N) 101(PCIE_RST) 102(NC)* 103(VDD_3V3) 109(NC)* 110(NC)* 111(NC)* 112(NC)* 114(VDD_3V3) 115(ECSPI2_SS0) 116(ECSPI1_SS0) 117(ECSPI2_SCLK) 118(ECSPI1_SCLK) 119(ECSPI2_CIPO) 120(ECSPI1_CIPO) 121(ECSPI2_COPI) 122(ECSPI1_COPI) 123(VDD_3V3) 126(GPIO_PF8) 128(GPIO_PF6) 129(SAI1_CK) 130(GPIO_PF3) 131(SAI1_FS) 132(GPIO_PF4) 133(SAI1_D0) 134(GPIO_PF12) 135(SAI1_D1) 139(TIM3_CH2) 140(TIM4_CH2) 141(TIM4_CH1) 142(TIM4_CH3) 143(TIM2_CH1) 144(TIM4_CH4) 145(TIM2_CH3) 146(TIM3_CH3) 148(TIM3_CH4) 149(VDD_3V3) 151(VREF+) 152(VREF-) 154(ADC12_INP4) 155(ADC12_INP3) 156(ADC3_INP3) 157(ADC2_INP2) 158(ADC3_INP2) 159(ADC12_INP5) 160(ADC3_INP4)

### Notes on the sheet
- Mosaic-Alto
- Portenta
- 5
- 7
- 1
- Alec Gheeraert

### Library data of the parts
J1 = CMP-00090-3: 80 Pin Arduino Pro Female; Mounting Angle: Vertical; Pins: 160; Mounting Style: SMD; Manufacturer: Arduino
R12 R13 = CMP-00030-4: as R14 on sheet MA-Mosaic; Max Operating Temperature: 155; Package: 0402; Min Operating Temperature: -55; Resistance: 4.7k

## Sheet MA-USBA.SchDoc
size A4; SheetNumber: 6; SheetTotal: 7
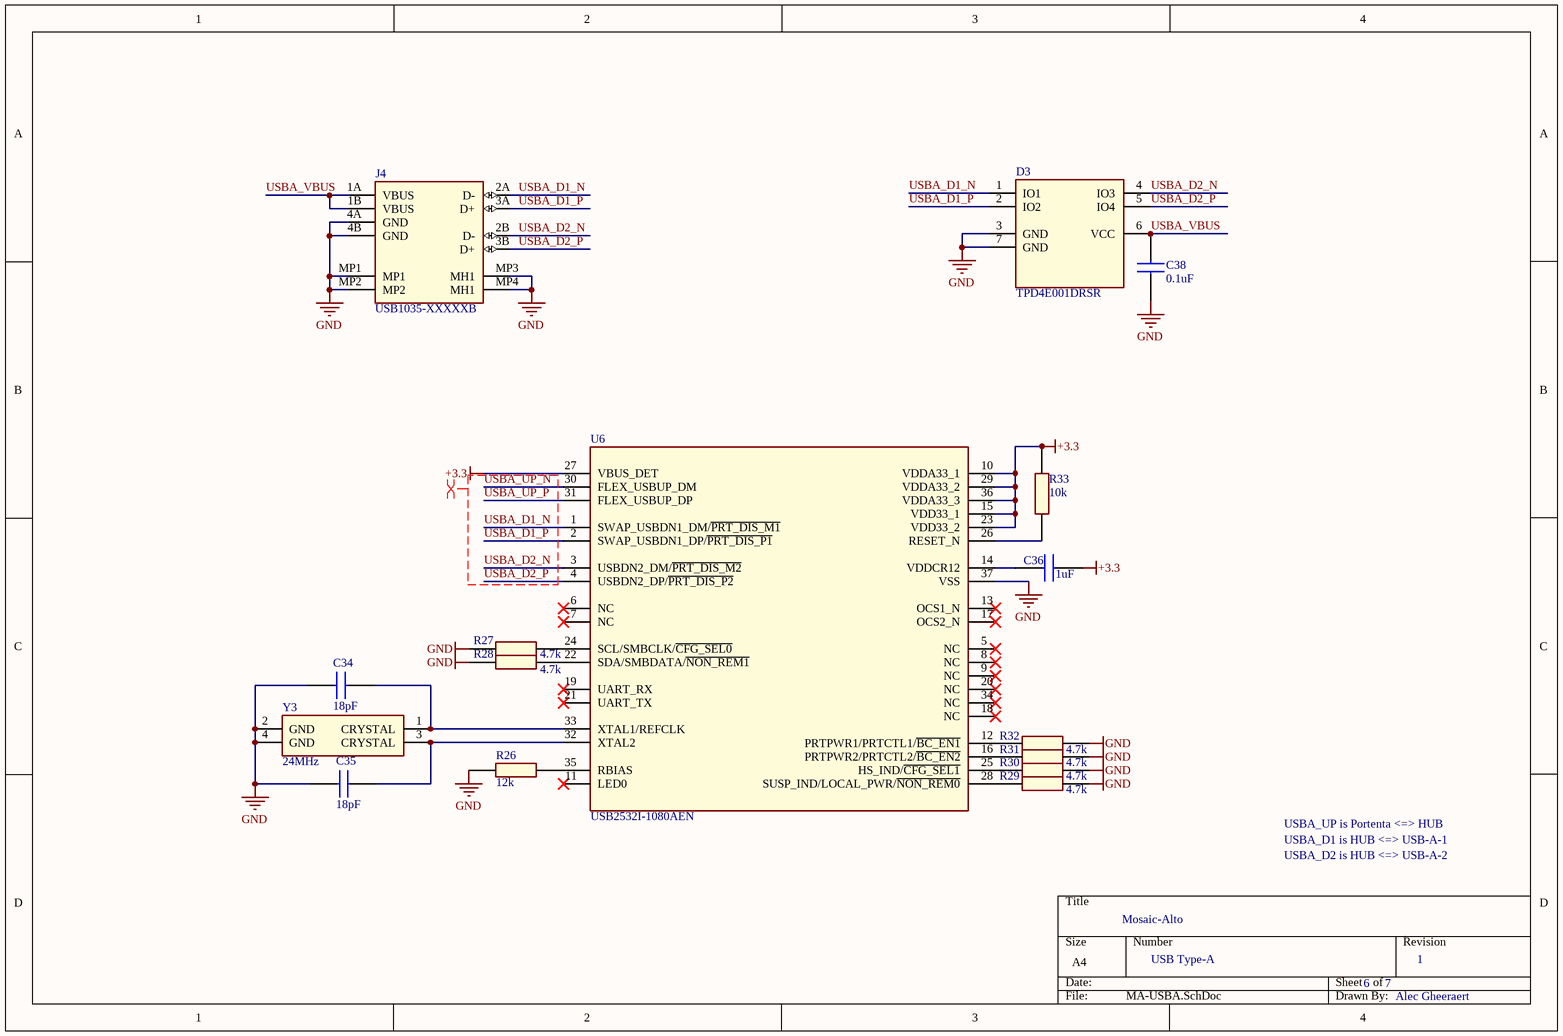
[diagram p5: MA-USBA.SchDoc]

### Parts
C34  18pF  [CAPC1608X87N]
C35  18pF  [CAPC1608X87N]
C36  1uF  [CAPC1608X100N]
C38  0.1uF  [CAPC1005X55N]
D3  TPD4E001DRSR  [SON95P300X300X80-7N-D]
J4  USB1035-XXXXXB  [USB1035-XXXXXB]
R26  12k  [RESC1005X40N]
R27  4.7k  [RESC1005X40N]
R28  4.7k  [RESC1005X40N]
R29  4.7k  [RESC1005X40N]
R30  4.7k  [RESC1005X40N]
R31  4.7k  [RESC1005X40N]
R32  4.7k  [RESC1005X40N]
R33  10k  [RESC1005X40N]
U6  USB2532I-1080AEN  [QFN50P600X600X100-37N-D]
Y3  24MHz  [LFXTAL071257Reel]

### Nets
+3.3: C36.2 R33.2 U6.10(VDDA33_1) U6.15(VDD33_1) U6.23(VDD33_2) U6.27(VBUS_DET) U6.29(VDDA33_2) U6.36(VDDA33_3)
GND: C34.2 C35.2 C38.2 D3.3(GND) D3.7(GND) J4.4A(GND) J4.4B(GND) J4.MP1 J4.MP2 J4.MP3(MH1) J4.MP4(MH1) R26.2 R27.2 R28.2 R29.2 R30.2 R31.2 R32.2 U6.37(VSS) Y3.2(GND) Y3.4(GND)
USBA_D1_N: D3.1(IO1) J4.2A(D-) U6.1(SWAP_USBDN1_DM/~{PRT_DIS_M1})
USBA_D1_P: D3.2(IO2) J4.3A(D+) U6.2(SWAP_USBDN1_DP/~{PRT_DIS_P1})
USBA_D2_N: D3.4(IO3) J4.2B(D-) U6.3(USBDN2_DM/~{PRT_DIS_M2})
USBA_D2_P: D3.5(IO4) J4.3B(D+) U6.4(USBDN2_DP/~{PRT_DIS_P2})
USBA_UP_N: U6.30(FLEX_USBUP_DM)
USBA_UP_P: U6.31(FLEX_USBUP_DP)
USBA_VBUS: C38.1 D3.6(VCC) J4.1A(VBUS) J4.1B(VBUS)
NetC34_1: C34.1 U6.33(XTAL1/REFCLK) Y3.1(CRYSTAL)
NetC35_1: C35.1 U6.32(XTAL2) Y3.3(CRYSTAL)
NetC36_1: C36.1 U6.14(VDDCR12)
NetR26_1: R26.1 U6.35(RBIAS)
NetR27_1: R27.1 U6.24(SCL/SMBCLK/~{CFG_SEL0})
NetR28_1: R28.1 U6.22(SDA/SMBDATA/~{NON_REM1})
NetR29_1: R29.1 U6.28(SUSP_IND/LOCAL_PWR/~{NON_REM0})
NetR30_1: R30.1 U6.25(HS_IND/~{CFG_SEL1})
NetR31_1: R31.1 U6.16(PRTPWR2/PRTCTL2/~{BC_EN2})
NetR32_1: R32.1 U6.12(PRTPWR1/PRTCTL1/~{BC_EN1})
NetR33_1: R33.1 U6.26(RESET_N)

Not connected (* = marked no-connect by the designer): U6 5(NC)* 6(NC)* 7(NC)* 8(NC)* 9(NC)* 11(LED0)* 13(OCS1_N)* 17(OCS2_N)* 18(NC)* 19(UART_RX)* 20(NC)* 21(UART_TX)* 34(NC)*

### Layout directives
differential pair; net class USBA; differential pair class USB: USBA_D1_N, USBA_D1_P, USBA_D2_N, USBA_D2_P, USBA_UP_N, USBA_UP_P

### Notes on the sheet
- USBA_UP is Portenta <=> HUB
- USBA_D1 is HUB <=> USB-A-1
- Mosaic-Alto
- USBA_D2 is HUB <=> USB-A-2
- USB Type-A
- 6
- 7
- 1
- Alec Gheeraert

### Library data of the parts
C34 C35 = CMP-00052-2: as C25 on sheet MA-Ethernet; Max Operating Temperature: 125; Package: 0603; Min Operating Temperature: -55; Capacitance: 18pF
C36 = CMP-00064-1: as C40 on sheet MA-Power; Package: 0603; Min Operating Temperature: -55; Max Operating Temperature: 85; Capacitance: 1µF
C38 = CMP-00051-3: as C28 on sheet MA-Mosaic; Min Operating Temperature: -55; Package: 0402; Max Operating Temperature: 125
D3 = CMP-00076-3: 4-Channel TVS Diodes; Channels: 4; Clamping Voltage: 25V; Breakdown Voltage: 11V; Working Voltage: 5.5V; Peak Pulse Current: 5.5A; Polarity: Unidirectional; Min Operating Temperature: -40; Package: WSON-6; Max Operating Temperature: 85
J4 = CMP-00038-9: USB-2.0 Type A Dual; Manufacturer: Global Connector Technologies; Current Rating: 1.8A; Gender: Female; Voltage Rating: 30V; Mounting Angle: Right; USB Type: A; Standard: 2.0; Mounting Style: PCB Mount
R26 = CMP-00068-1: 0402I 12k; Manufacturer: Walsin; Power Rating: 62.5mW; Tolerance: 1%; Qualification: AEC-Q200; Voltage Rating: 50V; Max Operating Temperature: 155; Resistance: 12k; Package: 0402; Min Operating Temperature: -55
R27-R32 = CMP-00030-4: as R14 on sheet MA-Mosaic; Max Operating Temperature: 155; Package: 0402; Min Operating Temperature: -55; Resistance: 4.7k
R33 = CMP-00026-5: as R15 on sheet MA-Power; Max Operating Temperature: 155; Resistance: 10k; Package: 0402; Min Operating Temperature: -55
U6 = CMP-00071-2: 2-Port USB-2.0 Controller Hub; Manufacturer: Microchip; Ports: 2; Data Rate: 480Mb/s; Package: SQFN-36; Standard: USB 2.0
Y3 = CMP-00067-2: 24MHz +/-100ppm Crystal; Manufacturer: IQD; Qualification: AEC-Q200; Tolerance: 10; Drive Level: 100µW; ESR: 100; Load Capacitance: 10pF; Min Operating Temperature: -40; Package: 2mm x 1.6mm; Frequency: 24MHz; Max Operating Temperature: 125

## Sheet MA-USBC.SchDoc
size A4; SheetNumber: 7; SheetTotal: 7
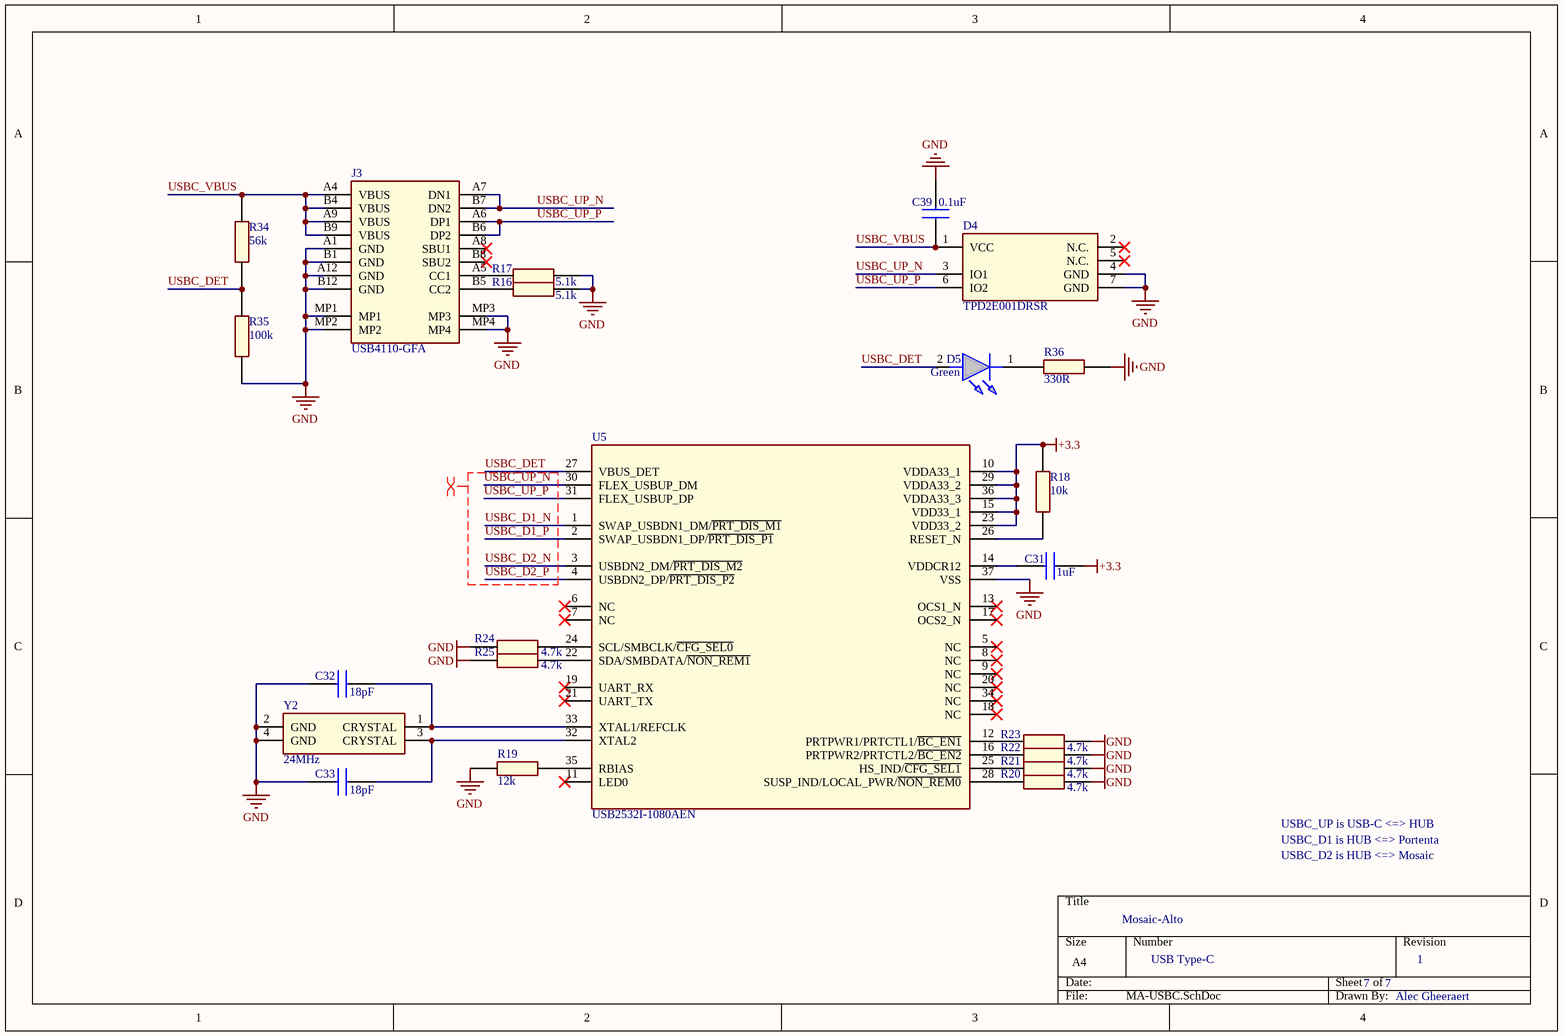
[diagram p6: MA-USBC.SchDoc]

### Parts
C31  1uF  [CAPC1608X100N]
C32  18pF  [CAPC1608X87N]
C33  18pF  [CAPC1608X87N]
C39  0.1uF  [CAPC2012X145N]
D4  TPD2E001DRSR  [SON95P300X300X80-7N-D]
D5  Green  [APT1608ZGCAMT]
J3  USB4110-GFA  [USB4110-GFA]
R16  5.1k  [RESC1608X60N]
R17  5.1k  [RESC1608X60N]
R18  10k  [RESC1005X40N]
R19  12k  [RESC1005X40N]
R20  4.7k  [RESC1005X40N]
R21  4.7k  [RESC1005X40N]
R22  4.7k  [RESC1005X40N]
R23  4.7k  [RESC1005X40N]
R24  4.7k  [RESC1005X40N]
R25  4.7k  [RESC1005X40N]
R34  56k  [RESC1005X40N]
R35  100k  [RESC1005X40N]
R36  330R  [RESC1005X40N]
U5  USB2532I-1080AEN  [QFN50P600X600X100-37N-D]
Y2  24MHz  [LFXTAL071257Reel]

### Nets
+3.3: C31.2 R18.2 U5.10(VDDA33_1) U5.15(VDD33_1) U5.23(VDD33_2) U5.29(VDDA33_2) U5.36(VDDA33_3)
GND: C32.1 C33.1 C39.2 D4.4(GND) D4.7(GND) J3.A1(GND) J3.A12(GND) J3.B1(GND) J3.B12(GND) J3.MP1 J3.MP2 J3.MP3 J3.MP4 R16.2 R17.2 R19.2 R20.2 R21.2 R22.2 R23.2 R24.1 R25.1 R35.2 R36.2 U5.37(VSS) Y2.2(GND) Y2.4(GND)
USBC_D1_N: U5.1(SWAP_USBDN1_DM/~{PRT_DIS_M1})
USBC_D1_P: U5.2(SWAP_USBDN1_DP/~{PRT_DIS_P1})
USBC_D2_N: U5.3(USBDN2_DM/~{PRT_DIS_M2})
USBC_D2_P: U5.4(USBDN2_DP/~{PRT_DIS_P2})
USBC_DET: D5.2(A) R34.2 R35.1 U5.27(VBUS_DET)
USBC_UP_N: D4.3(IO1) J3.A7(DN1) J3.B7(DN2) U5.30(FLEX_USBUP_DM)
USBC_UP_P: D4.6(IO2) J3.A6(DP1) J3.B6(DP2) U5.31(FLEX_USBUP_DP)
USBC_VBUS: C39.1 D4.1(VCC) J3.A4(VBUS) J3.A9(VBUS) J3.B4(VBUS) J3.B9(VBUS) R34.1
NetC31_1: C31.1 U5.14(VDDCR12)
NetC32_2: C32.2 U5.33(XTAL1/REFCLK) Y2.1(CRYSTAL)
NetC33_2: C33.2 U5.32(XTAL2) Y2.3(CRYSTAL)
NetD5_1: D5.1(K) R36.1
NetJ3_A5: J3.A5(CC1) R17.1
NetJ3_B5: J3.B5(CC2) R16.1
NetR18_1: R18.1 U5.26(RESET_N)
NetR19_1: R19.1 U5.35(RBIAS)
NetR20_1: R20.1 U5.28(SUSP_IND/LOCAL_PWR/~{NON_REM0})
NetR21_1: R21.1 U5.25(HS_IND/~{CFG_SEL1})
NetR22_1: R22.1 U5.16(PRTPWR2/PRTCTL2/~{BC_EN2})
NetR23_1: R23.1 U5.12(PRTPWR1/PRTCTL1/~{BC_EN1})
NetR24_2: R24.2 U5.24(SCL/SMBCLK/~{CFG_SEL0})
NetR25_2: R25.2 U5.22(SDA/SMBDATA/~{NON_REM1})

Not connected (* = marked no-connect by the designer): D4 2(N.C.)* 5(N.C.)*; J3 A8(SBU1)* B8(SBU2)*; U5 5(NC)* 6(NC)* 7(NC)* 8(NC)* 9(NC)* 11(LED0)* 13(OCS1_N)* 17(OCS2_N)* 18(NC)* 19(UART_RX)* 20(NC)* 21(UART_TX)* 34(NC)*

### Layout directives
differential pair; net class USBC; differential pair class USB: USBC_D1_N, USBC_D1_P, USBC_D2_N, USBC_D2_P, USBC_UP_N, USBC_UP_P

### Notes on the sheet
- USBC_UP is USB-C <=> HUB
- USBC_D1 is HUB <=> Portenta
- Mosaic-Alto
- USBC_D2 is HUB <=> Mosaic
- USB Type-C
- 7
- 1
- Alec Gheeraert

### Library data of the parts
C31 = CMP-00064-1: as C40 on sheet MA-Power; Package: 0603; Min Operating Temperature: -55; Max Operating Temperature: 85; Capacitance: 1µF
C32 C33 = CMP-00052-2: as C25 on sheet MA-Ethernet; Max Operating Temperature: 125; Package: 0603; Min Operating Temperature: -55; Capacitance: 18pF
C39 = CMP-00059-1: as C27 on sheet MA-Ethernet; Min Operating Temperature: 125; Max Operating Temperature: -55; Package: 0805
D4 = CMP-00078-2: 2-Channel TVS Diode; Polarity: Unidirectional; Breakdown Voltage: 11V; Channels: 2; Clamping Voltage: 25V; Peak Pulse Current: 10A; Working Voltage: 5.5V; Max Operating Temperature: 85; Package: WSON-6; Min Operating Temperature: -40
D5 = CMP-00079-2: 0603 Green LED; Colour: Green
J3 = CMP-00039-5: USB-2.0 Type C; Manufacturer: Global Connector Technologies; Mounting Angle: Right; Current Rating: 5A; Voltage Rating: 48V; Gender: Female; Standard: 2.0; USB Type: C; Mounting Style: Top Mount
R16 R17 = CMP-00065-3: 0603I 5.1k; Manufacturer: Walsin; Voltage Rating: 50V; Qualification: AEC-Q200; Tolerance: 1%; Power Rating: 62.5mW; Min Operating Temperature: -55; Package: 0603; Max Operating Temperature: 155; Resistance: 5.1k
R18 = CMP-00026-5: as R15 on sheet MA-Power; Max Operating Temperature: 155; Resistance: 10k; Package: 0402; Min Operating Temperature: -55
R19 = CMP-00068-1: as R26 on sheet MA-USBA; Max Operating Temperature: 155; Resistance: 12k; Package: 0402; Min Operating Temperature: -55
R20-R25 = CMP-00030-4: as R14 on sheet MA-Mosaic; Max Operating Temperature: 155; Package: 0402; Min Operating Temperature: -55; Resistance: 4.7k
R34 = CMP-00075-1: as R42 on sheet MA-Power; Package: 0402; Resistance: 56k; Min Operating Temperature: -55; Max Operating Temperature: 155
R35 = CMP-00029-4: as R38 on sheet MA-Power; Package: 0402; Resistance: 100k; Max Operating Temperature: 155; Min Operating Temperature: -55
R36 = CMP-00028-4: as R10 on sheet MA-Ethernet; Max Operating Temperature: 155; Package: 0402; Min Operating Temperature: -55
U5 = CMP-00071-2: as U6 on sheet MA-USBA; Package: SQFN-36; Standard: USB 2.0
Y2 = CMP-00067-2: as Y3 on sheet MA-USBA; Min Operating Temperature: -40; Package: 2mm x 1.6mm; Frequency: 24MHz; Max Operating Temperature: 125

## Nets that join several sheets
+3.3: MA-Mosaic (15 pins), MA-Ethernet (R3.1 R5.1 R7.1 R9.1), MA-Power (23 pins), MA-Portenta (R12.2 R13.1), MA-USBA (8 pins), MA-USBC (7 pins)
+5: MA-Support (J8.12), MA-Power (9 pins), MA-Portenta (J1.21 J1.32 J1.41 J1.48)
GND: MA-Mosaic (18 pins), MA-Ethernet (14 pins), MA-Support (113 pins), MA-Power (44 pins), MA-Portenta (11 pins), MA-USBA (21 pins), MA-USBC (27 pins)
CAN_RX0: MA-Support (J8.6), MA-Portenta (J1.52)
CAN_RX1: MA-Support (J8.7), MA-Portenta (J1.51)
CAN_TX0: MA-Support (J8.19), MA-Portenta (J1.50)
CAN_TX1: MA-Support (J8.18), MA-Portenta (J1.49)
CTRL_SCL: MA-Ethernet (U3.50), MA-Portenta (J1.45 R12.1)
CTRL_SDA: MA-Ethernet (U3.48), MA-Portenta (J1.43 R13.2)
ETH_2A_N: MA-Ethernet (U3.10), MA-Portenta (J1.3)
ETH_2A_P: MA-Ethernet (U3.9), MA-Portenta (J1.1)
ETH_2B_N: MA-Ethernet (U3.13), MA-Portenta (J1.7)
ETH_2B_P: MA-Ethernet (U3.12), MA-Portenta (J1.5)
ETH_2C_N: MA-Ethernet (U3.15), MA-Portenta (J1.11)
ETH_2C_P: MA-Ethernet (U3.14), MA-Portenta (J1.9)
ETH_2D_N: MA-Ethernet (U3.18), MA-Portenta (J1.15)
ETH_2D_P: MA-Ethernet (U3.17), MA-Portenta (J1.13)
ETH_RST_N: MA-Ethernet (U3.46), MA-Power (C30.1 D1.1 R15.2)
I2C_SCL0: MA-Support (J8.8), MA-Portenta (J1.46)
I2C_SCL1: MA-Support (J8.9), MA-Portenta (J1.127)
I2C_SDA0: MA-Support (J8.17), MA-Portenta (J1.44)
I2C_SDA1: MA-Support (J8.16), MA-Portenta (J1.125)
MOS_EVA: MA-Mosaic (U4.12), MA-Support (J8.24)
MOS_EVB: MA-Mosaic (U4.13), MA-Support (J8.23)
MOS_GP1: MA-Mosaic (U1.AA4), MA-Support (J8.2)
MOS_PPS: MA-Mosaic (U4.14), MA-Ethernet (U3.39), MA-Support (J8.1)
MOS_RX1: MA-Mosaic (U1.B1), MA-Support (J8.3)
MOS_RX3: MA-Mosaic (U1.K1), MA-Portenta (J1.106)
MOS_RX4: MA-Mosaic (U1.D3), MA-Portenta (J1.105)
MOS_TX1: MA-Mosaic (U1.D1), MA-Support (J8.22)
MOS_TX3: MA-Mosaic (U1.M1), MA-Portenta (J1.108)
MOS_TX4: MA-Mosaic (U1.E3), MA-Portenta (J1.107)
PRO_ADC0: MA-Support (J8.14), MA-Portenta (J1.153)
PRO_GP0: MA-Support (J8.10), MA-Portenta (J1.136)
PRO_GP1: MA-Support (J8.11), MA-Portenta (J1.138)
PRO_RX0: MA-Support (J8.4), MA-Portenta (J1.35)
PRO_RX1: MA-Support (J8.5), MA-Portenta (J1.36)
PRO_TIM0: MA-Support (J8.15), MA-Portenta (J1.147)
PRO_TX0: MA-Support (J8.21), MA-Portenta (J1.33)
PRO_TX1: MA-Support (J8.20), MA-Portenta (J1.34)
RMII_CLK: MA-Mosaic (U1.AA2), MA-Ethernet (U3.33)
RMII_CRSDV: MA-Mosaic (U1.N2), MA-Ethernet (U3.27)
RMII_RXD0: MA-Mosaic (U1.R2), MA-Ethernet (R7.2 U3.24)
RMII_RXD1: MA-Mosaic (U1.T2), MA-Ethernet (R6.2 U3.23)
RMII_TXD0: MA-Mosaic (U1.J2), MA-Ethernet (U3.32)
RMII_TXD1: MA-Mosaic (U1.H2), MA-Ethernet (U3.31)
RMII_TXEN: MA-Mosaic (U1.L2), MA-Ethernet (U3.35)
USBA_UP_N: MA-Portenta (J1.28), MA-USBA (U6.30)
USBA_UP_P: MA-Portenta (J1.26), MA-USBA (U6.31)
USBA_VBUS: MA-Portenta (J1.24), MA-USBA (C38.1 D3.6 J4.1A J4.1B)
USBC_D1_N: MA-Portenta (J1.27), MA-USBC (U5.1)
USBC_D1_P: MA-Portenta (J1.25), MA-USBC (U5.2)
USBC_D2_N: MA-Mosaic (U1.A6), MA-USBC (U5.3)
USBC_D2_P: MA-Mosaic (U1.A5), MA-USBC (U5.4)
USBC_VBUS: MA-Mosaic (U1.A8), MA-Power (U7.3 U7.4 U7.5), MA-Portenta (J1.23), MA-USBC (7 pins)